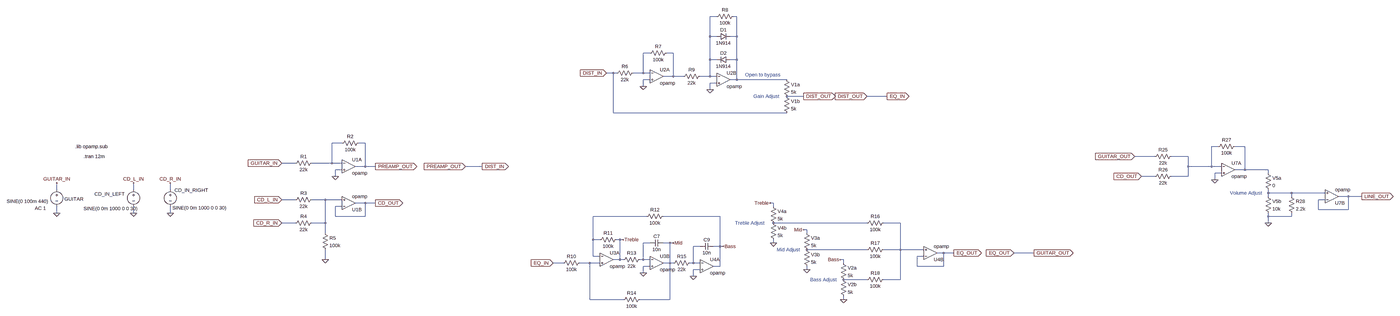
[diagram p0: schematic Project_Amp_RevA.asc, whole sheet]
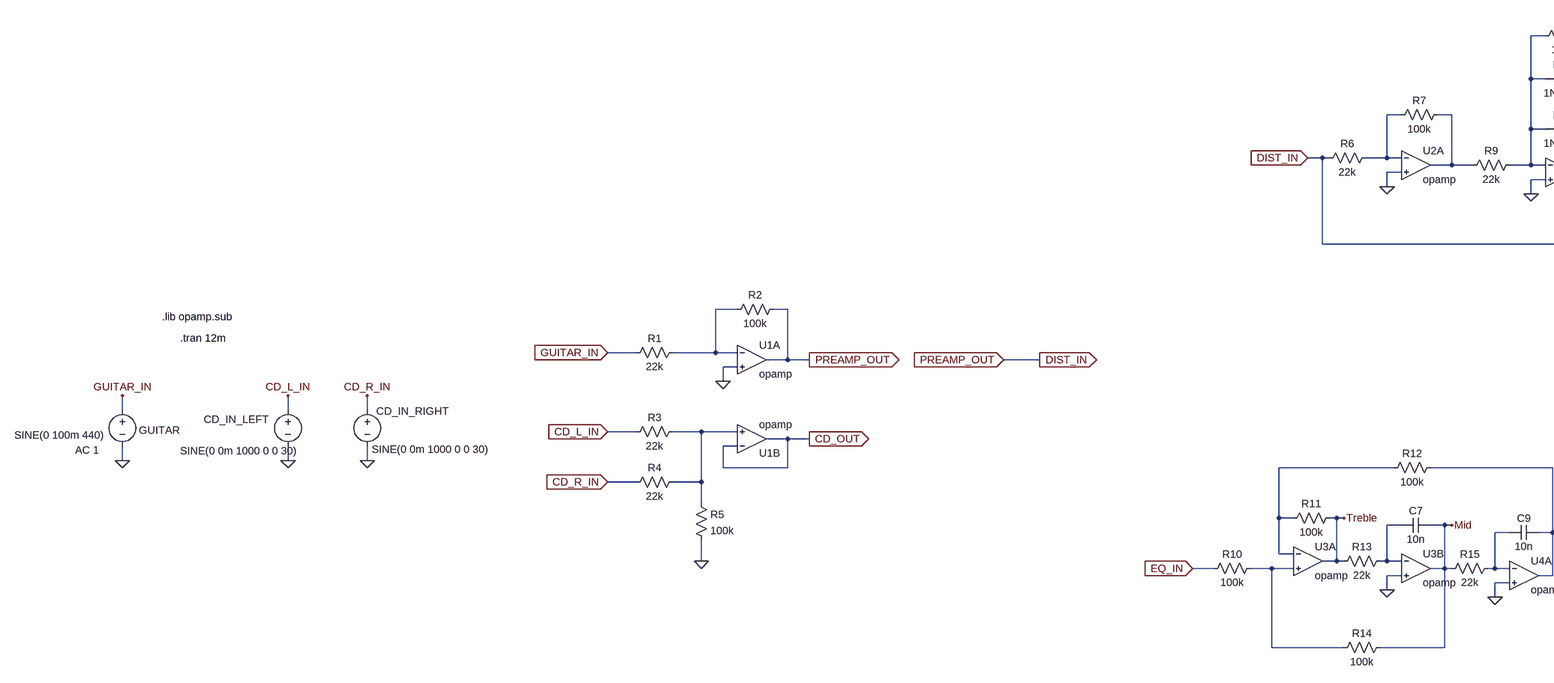
[diagram p1: schematic Project_Amp_RevA.asc, part, row 1 of 1, column 1 of 2]
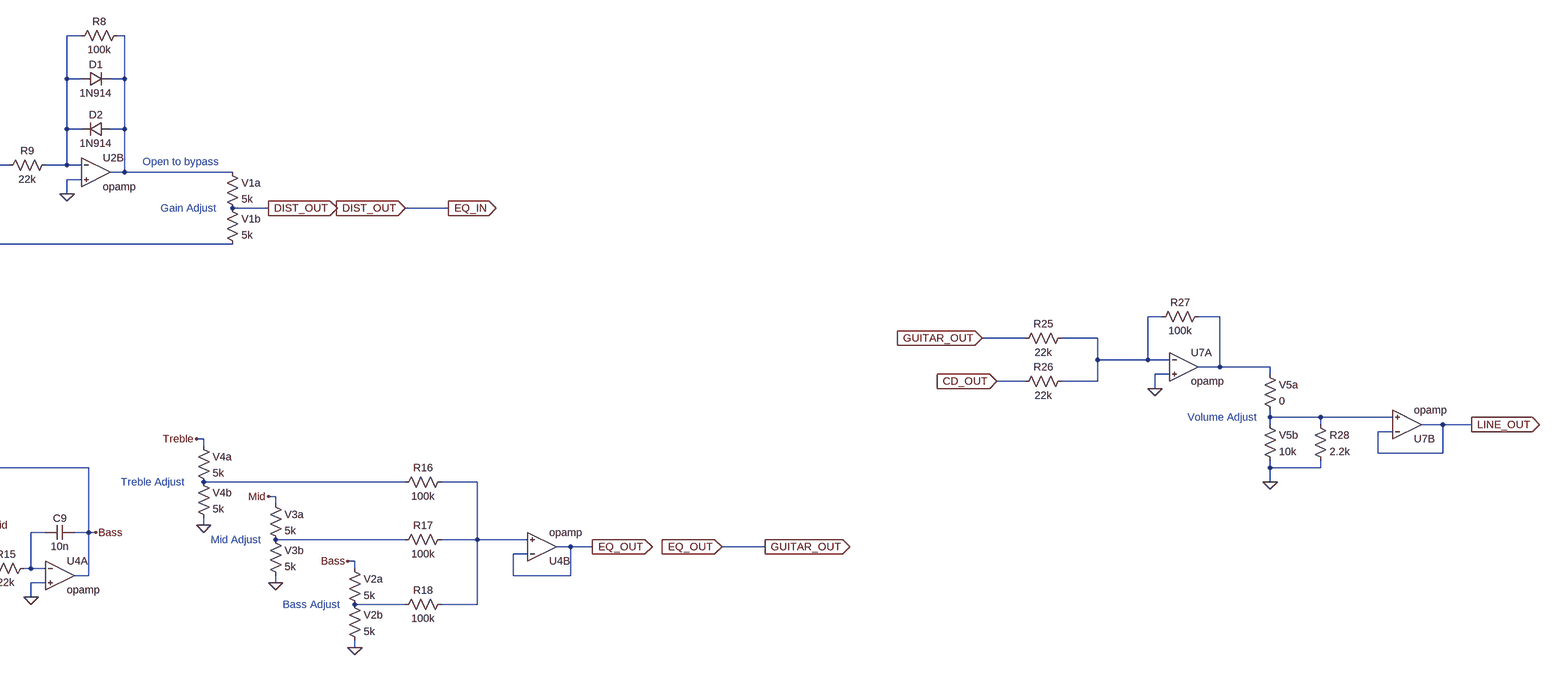
[diagram p2: schematic Project_Amp_RevA.asc, part, row 1 of 1, column 2 of 2]
Project_Amp_RevA.asc, the LTspice schematic file:
Version 4
SHEET 1 5956 1528
WIRE 2224 -304 2192 -304
WIRE 2320 -304 2304 -304
WIRE 2192 -208 2192 -304
WIRE 2224 -208 2192 -208
WIRE 2320 -208 2320 -304
WIRE 2320 -208 2288 -208
WIRE 1904 -128 1872 -128
WIRE 2016 -128 1984 -128
WIRE 2192 -96 2192 -208
WIRE 2224 -96 2192 -96
WIRE 2320 -96 2320 -208
WIRE 2320 -96 2288 -96
WIRE 1728 -32 1696 -32
WIRE 1744 -32 1728 -32
WIRE 1872 -32 1872 -128
WIRE 1872 -32 1824 -32
WIRE 1904 -32 1872 -32
WIRE 2016 -16 2016 -128
WIRE 2016 -16 1968 -16
WIRE 2064 -16 2016 -16
WIRE 2192 -16 2192 -96
WIRE 2192 -16 2144 -16
WIRE 2224 -16 2192 -16
WIRE 1904 0 1872 0
WIRE 2320 0 2320 -96
WIRE 2320 0 2288 0
WIRE 2560 0 2320 0
WIRE 2224 16 2192 16
WIRE 1872 32 1872 0
WIRE 2192 48 2192 16
WIRE 2640 80 2560 80
WIRE 3040 80 2944 80
WIRE 1728 160 1728 -32
WIRE 2560 160 1728 160
WIRE 320 320 272 320
WIRE 432 320 400 320
WIRE 4832 336 4800 336
WIRE 4960 336 4912 336
WIRE 4528 384 4432 384
WIRE 4688 384 4608 384
WIRE 96 416 32 416
WIRE 272 416 272 320
WIRE 272 416 176 416
WIRE 320 416 272 416
WIRE 432 432 432 320
WIRE 432 432 384 432
WIRE 480 432 432 432
WIRE 992 432 912 432
WIRE 4688 432 4688 384
WIRE 4800 432 4800 336
WIRE 4800 432 4688 432
WIRE 4848 432 4800 432
WIRE 320 448 288 448
WIRE 4960 448 4960 336
WIRE 4960 448 4912 448
WIRE 5072 448 4960 448
WIRE 4848 464 4816 464
WIRE 5072 464 5072 448
WIRE 288 480 288 448
WIRE 4528 480 4464 480
WIRE 4688 480 4688 432
WIRE 4688 480 4608 480
WIRE 4816 496 4816 464
WIRE -1360 544 -1360 512
WIRE -992 544 -992 512
WIRE -816 544 -816 512
WIRE 5072 560 5072 544
WIRE 5184 560 5072 560
WIRE 5344 560 5184 560
WIRE 5072 576 5072 560
WIRE 5184 576 5184 560
WIRE 5456 576 5408 576
WIRE 5520 576 5456 576
WIRE 96 592 32 592
WIRE 240 592 176 592
WIRE 320 592 240 592
WIRE 5344 592 5312 592
WIRE 432 608 384 608
WIRE 480 608 432 608
WIRE 2496 608 2480 608
WIRE 320 624 288 624
WIRE 2496 624 2496 608
WIRE 5312 640 5312 592
WIRE 5456 640 5456 576
WIRE 5456 640 5312 640
WIRE -1360 656 -1360 624
WIRE -992 656 -992 624
WIRE -816 656 -816 624
WIRE 288 672 288 624
WIRE 432 672 432 608
WIRE 432 672 288 672
WIRE 1888 672 1632 672
WIRE 2240 672 1968 672
WIRE 5072 672 5072 656
WIRE 5184 672 5184 656
WIRE 5184 672 5072 672
WIRE 96 704 32 704
WIRE 240 704 240 592
WIRE 240 704 176 704
WIRE 2944 704 2496 704
WIRE 3104 704 3024 704
WIRE 5072 704 5072 672
WIRE 2656 736 2640 736
WIRE 240 752 240 704
WIRE 2656 752 2656 736
WIRE 1632 784 1632 672
WIRE 1664 784 1632 784
WIRE 1760 784 1744 784
WIRE 1776 784 1760 784
WIRE 1904 800 1872 800
WIRE 2000 800 1968 800
WIRE 2016 800 2000 800
WIRE 2496 800 2496 784
WIRE 2144 816 2112 816
WIRE 2240 816 2240 672
WIRE 2240 816 2208 816
WIRE 2256 816 2240 816
WIRE 2944 832 2656 832
WIRE 3104 832 3104 704
WIRE 3104 832 3024 832
WIRE 3216 832 3104 832
WIRE 3312 848 3280 848
WIRE 3360 848 3312 848
WIRE 3744 848 3648 848
WIRE 1632 864 1632 784
WIRE 1664 864 1632 864
WIRE 3216 864 3184 864
WIRE 240 880 240 832
WIRE 1760 880 1760 784
WIRE 1760 880 1728 880
WIRE 1776 880 1760 880
WIRE 1872 880 1872 800
WIRE 1872 880 1856 880
WIRE 1904 880 1872 880
WIRE 2832 880 2816 880
WIRE 1488 896 1440 896
WIRE 1616 896 1568 896
WIRE 1664 896 1616 896
WIRE 2000 896 2000 800
WIRE 2000 896 1968 896
WIRE 2016 896 2000 896
WIRE 2112 896 2112 816
WIRE 2112 896 2096 896
WIRE 2144 896 2112 896
WIRE 2832 896 2832 880
WIRE 1904 912 1872 912
WIRE 2240 912 2240 816
WIRE 2240 912 2208 912
WIRE 3184 912 3184 864
WIRE 3312 912 3312 848
WIRE 3312 912 3184 912
WIRE 2144 928 2112 928
WIRE 2656 928 2656 912
WIRE 1872 944 1872 912
WIRE 2112 960 2112 928
WIRE 2944 976 2832 976
WIRE 3104 976 3104 832
WIRE 3104 976 3024 976
WIRE 1616 1072 1616 896
WIRE 1776 1072 1616 1072
WIRE 2000 1072 2000 896
WIRE 2000 1072 1856 1072
WIRE 2832 1072 2832 1056
FLAG -992 656 0
FLAG 5520 576 LINE_OUT
IOPIN 5520 576 Out
FLAG 5072 704 0
FLAG -816 656 0
FLAG -1360 656 0
FLAG 288 480 0
FLAG 4816 496 0
FLAG 240 880 0
FLAG 1696 -32 DIST_IN
IOPIN 1696 -32 In
FLAG 2640 80 DIST_OUT
IOPIN 2640 80 Out
FLAG 1872 32 0
FLAG 2192 48 0
FLAG 480 432 PREAMP_OUT
IOPIN 480 432 Out
FLAG 1776 784 Treble
FLAG 2016 800 Mid
FLAG 2256 816 Bass
FLAG 2480 608 Treble
FLAG 2640 736 Mid
FLAG 2816 880 Bass
FLAG 1440 896 EQ_IN
IOPIN 1440 896 In
FLAG 3360 848 EQ_OUT
IOPIN 3360 848 Out
FLAG 1872 944 0
FLAG 2112 960 0
FLAG 2496 800 0
FLAG 2656 928 0
FLAG 2832 1072 0
FLAG 4432 384 GUITAR_OUT
IOPIN 4432 384 In
FLAG 32 416 GUITAR_IN
IOPIN 32 416 In
FLAG 32 592 CD_L_IN
IOPIN 32 592 In
FLAG 32 704 CD_R_IN
IOPIN 32 704 In
FLAG 480 608 CD_OUT
IOPIN 480 608 Out
FLAG 4464 480 CD_OUT
IOPIN 4464 480 In
FLAG -1360 512 GUITAR_IN
FLAG -992 512 CD_L_IN
FLAG -816 512 CD_R_IN
FLAG 2944 80 DIST_OUT
IOPIN 2944 80 In
FLAG 3040 80 EQ_IN
IOPIN 3040 80 Out
FLAG 3648 848 EQ_OUT
IOPIN 3648 848 In
FLAG 3744 848 GUITAR_OUT
IOPIN 3744 848 Out
FLAG 912 432 PREAMP_OUT
IOPIN 912 432 In
FLAG 992 432 DIST_IN
IOPIN 992 432 Out
SYMBOL voltage -1360 528 R0
WINDOW 123 -105 105 Left 2
WINDOW 39 0 0 Left 2
WINDOW 3 -240 72 Left 2
WINDOW 0 37 61 Left 2
SYMATTR Value2 AC 1
SYMATTR Value SINE(0 100m 440)
SYMATTR InstName GUITAR
SYMBOL Opamps\\opamp 352 368 R0
SYMATTR InstName U1A
SYMBOL voltage -992 528 R0
WINDOW 123 0 0 Left 2
WINDOW 39 0 0 Left 2
WINDOW 3 -240 107 Left 2
WINDOW 0 -187 37 Left 2
SYMATTR Value SINE(0 0m 1000 0 0 30)
SYMATTR InstName CD_IN_LEFT
SYMBOL res 4624 368 R90
WINDOW 0 0 56 VBottom 2
WINDOW 3 32 56 VTop 2
SYMATTR InstName R25
SYMATTR Value 22k
SYMBOL Opamps\\opamp 4880 384 R0
SYMATTR InstName U7A
SYMBOL res 5056 448 R0
SYMATTR InstName V5a
SYMATTR Value 0
SYMBOL res 5056 560 R0
SYMATTR InstName V5b
SYMATTR Value 10k
SYMBOL res 5168 560 R0
SYMATTR InstName R28
SYMATTR Value 2.2k
SYMBOL Opamps\\opamp 5376 640 M180
SYMATTR InstName U7B
SYMBOL voltage -816 528 M0
WINDOW 123 0 0 Left 2
WINDOW 39 0 0 Left 2
WINDOW 3 -271 103 Left 2
WINDOW 0 -181 18 Left 2
SYMATTR Value SINE(0 0m 1000 0 0 30)
SYMATTR InstName CD_IN_RIGHT
SYMBOL res 192 576 R90
WINDOW 0 0 56 VBottom 2
WINDOW 3 32 56 VTop 2
SYMATTR InstName R3
SYMATTR Value 22k
SYMBOL res 192 688 R90
WINDOW 0 0 56 VBottom 2
WINDOW 3 32 56 VTop 2
SYMATTR InstName R4
SYMATTR Value 22k
SYMBOL Opamps\\opamp 352 672 M180
SYMATTR InstName U1B
SYMBOL res 4624 464 R90
WINDOW 0 0 56 VBottom 2
WINDOW 3 32 56 VTop 2
SYMATTR InstName R26
SYMATTR Value 22k
SYMBOL res 192 400 R90
WINDOW 0 0 56 VBottom 2
WINDOW 3 32 56 VTop 2
SYMATTR InstName R1
SYMATTR Value 22k
SYMBOL res 416 304 R90
WINDOW 0 0 56 VBottom 2
WINDOW 3 32 56 VTop 2
SYMATTR InstName R2
SYMATTR Value 100k
SYMBOL res 4928 320 R90
WINDOW 0 0 56 VBottom 2
WINDOW 3 32 56 VTop 2
SYMATTR InstName R27
SYMATTR Value 100k
SYMBOL res 224 736 R0
SYMATTR InstName R5
SYMATTR Value 100k
SYMBOL Opamps\\opamp 2256 -64 R0
SYMATTR InstName U2B
SYMBOL res 2160 -32 R90
WINDOW 0 0 56 VBottom 2
WINDOW 3 32 56 VTop 2
SYMATTR InstName R9
SYMATTR Value 22k
SYMBOL res 2320 -320 R90
WINDOW 0 0 56 VBottom 2
WINDOW 3 32 56 VTop 2
SYMATTR InstName R8
SYMATTR Value 100k
SYMBOL diode 2224 -192 R270
WINDOW 0 32 32 VTop 2
WINDOW 3 0 32 VBottom 2
SYMATTR InstName D1
SYMATTR Value 1N914
SYMBOL diode 2288 -112 R90
WINDOW 0 0 32 VBottom 2
WINDOW 3 32 32 VTop 2
SYMATTR InstName D2
SYMATTR Value 1N914
SYMBOL Opamps\\opamp 1936 -80 R0
SYMATTR InstName U2A
SYMBOL res 2000 -144 R90
WINDOW 0 0 56 VBottom 2
WINDOW 3 32 56 VTop 2
SYMATTR InstName R7
SYMATTR Value 100k
SYMBOL res 1728 -16 R270
WINDOW 0 32 56 VTop 2
WINDOW 3 0 56 VBottom 2
SYMATTR InstName R6
SYMATTR Value 22k
SYMBOL res 2544 -16 R0
SYMATTR InstName V1a
SYMATTR Value 5k
SYMBOL res 2544 64 R0
SYMATTR InstName V1b
SYMATTR Value 5k
SYMBOL Opamps\\opamp 1696 816 R0
SYMATTR InstName U3A
SYMBOL Opamps\\opamp 1936 832 R0
SYMATTR InstName U3B
SYMBOL Opamps\\opamp 2176 848 R0
SYMATTR InstName U4A
SYMBOL Opamps\\opamp 3248 912 M180
SYMATTR InstName U4B
SYMBOL res 1584 880 R90
WINDOW 0 0 56 VBottom 2
WINDOW 3 32 56 VTop 2
SYMATTR InstName R10
SYMATTR Value 100k
SYMBOL res 1872 1056 R90
WINDOW 0 0 56 VBottom 2
WINDOW 3 32 56 VTop 2
SYMATTR InstName R14
SYMATTR Value 100k
SYMBOL res 1760 768 R90
WINDOW 0 0 56 VBottom 2
WINDOW 3 32 56 VTop 2
SYMATTR InstName R11
SYMATTR Value 100k
SYMBOL res 1872 864 R90
WINDOW 0 0 56 VBottom 2
WINDOW 3 32 56 VTop 2
SYMATTR InstName R13
SYMATTR Value 22k
SYMBOL res 2112 880 R90
WINDOW 0 0 56 VBottom 2
WINDOW 3 32 56 VTop 2
SYMATTR InstName R15
SYMATTR Value 22k
SYMBOL cap 1968 784 R90
WINDOW 0 0 32 VBottom 2
WINDOW 3 32 32 VTop 2
SYMATTR InstName C7
SYMATTR Value 10n
SYMBOL cap 2208 800 R90
WINDOW 0 0 32 VBottom 2
WINDOW 3 32 32 VTop 2
SYMATTR InstName C9
SYMATTR Value 10n
SYMBOL res 1984 656 R90
WINDOW 0 0 56 VBottom 2
WINDOW 3 32 56 VTop 2
SYMATTR InstName R12
SYMATTR Value 100k
SYMBOL res 3040 688 R90
WINDOW 0 0 56 VBottom 2
WINDOW 3 32 56 VTop 2
SYMATTR InstName R16
SYMATTR Value 100k
SYMBOL res 3040 816 R90
WINDOW 0 0 56 VBottom 2
WINDOW 3 32 56 VTop 2
SYMATTR InstName R17
SYMATTR Value 100k
SYMBOL res 3040 960 R90
WINDOW 0 0 56 VBottom 2
WINDOW 3 32 56 VTop 2
SYMATTR InstName R18
SYMATTR Value 100k
SYMBOL res 2480 688 R0
SYMATTR InstName V4b
SYMATTR Value 5k
SYMBOL res 2640 816 R0
SYMATTR InstName V3b
SYMATTR Value 5k
SYMBOL res 2816 960 R0
SYMATTR InstName V2b
SYMATTR Value 5k
SYMBOL res 2480 608 R0
SYMATTR InstName V4a
SYMATTR Value 5k
SYMBOL res 2640 736 R0
SYMATTR InstName V3a
SYMATTR Value 5k
SYMBOL res 2816 880 R0
SYMATTR InstName V2a
SYMATTR Value 5k
TEXT -1272 336 Left 2 !.lib opamp.sub
TEXT 4888 560 Left 2 ;Volume Adjust
TEXT -1232 384 Left 2 !.tran 12m
TEXT 2360 -24 Left 2 ;Open to bypass
TEXT 2400 80 Left 2 ;Gain Adjust
TEXT 2312 704 Left 2 ;Treble Adjust
TEXT 2512 832 Left 2 ;Mid Adjust
TEXT 2672 976 Left 2 ;Bass Adjust

The netlist it stands for:
* Project_Amp_RevA.asc
V§GUITAR GUITAR_IN 0 SINE(0 100m 440) AC 1
XU1A N005 0 PREAMP_OUT opamp Aol=100K GBW=10Meg  ; pins invin noninvin out
V§CD_IN_LEFT CD_L_IN 0 SINE(0 0m 1000 0 0 30)
R25 N006 GUITAR_OUT 22k
XU7A N006 0 N007 opamp Aol=100K GBW=10Meg  ; pins invin noninvin out
R§V5a N007 N008 0
R§V5b N008 0 10k
R28 N008 0 2.2k
XU7B LINE_OUT N008 LINE_OUT opamp Aol=100K GBW=10Meg  ; pins invin noninvin out
V§CD_IN_RIGHT CD_R_IN 0 SINE(0 0m 1000 0 0 30)
R3 N009 CD_L_IN 22k
R4 N009 CD_R_IN 22k
XU1B CD_OUT N009 CD_OUT opamp Aol=100K GBW=10Meg  ; pins invin noninvin out
R26 N006 CD_OUT 22k
R1 N005 GUITAR_IN 22k
R2 PREAMP_OUT N005 100k
R27 N007 N006 100k
R5 N009 0 100k
XU2B N001 0 N002 opamp Aol=100K GBW=10Meg  ; pins invin noninvin out
R9 N001 N004 22k
R8 N002 N001 100k
D1 N001 N002 1N914
D2 N002 N001 1N914
XU2A N003 0 N004 opamp Aol=100K GBW=10Meg  ; pins invin noninvin out
R7 N004 N003 100k
R6 PREAMP_OUT N003 22k
R§V1a N002 EQ_IN 5k
R§V1b EQ_IN PREAMP_OUT 5k
XU3A N010 N016 Treble opamp Aol=100K GBW=10Meg  ; pins invin noninvin out
XU3B N013 0 Mid opamp Aol=100K GBW=10Meg  ; pins invin noninvin out
XU4A N014 0 Bass opamp Aol=100K GBW=10Meg  ; pins invin noninvin out
XU4B GUITAR_OUT N012 GUITAR_OUT opamp Aol=100K GBW=10Meg  ; pins invin noninvin out
R10 N016 EQ_IN 100k
R14 Mid N016 100k
R11 Treble N010 100k
R13 N013 Treble 22k
R15 N014 Mid 22k
C7 Mid N013 10n
C9 Bass N014 10n
R12 Bass N010 100k
R16 N012 N011 100k
R17 N012 N015 100k
R18 N012 N017 100k
R§V4b N011 0 5k
R§V3b N015 0 5k
R§V2b N017 0 5k
R§V4a Treble N011 5k
R§V3a Mid N015 5k
R§V2a Bass N017 5k
.model D D
.lib standard.dio
.lib opamp.sub
* Volume Adjust
.tran 12m
* Open to bypass
* Gain Adjust
* Treble Adjust
* Mid Adjust
* Bass Adjust
.backanno
.end